# Altium schematic sheet Telemetry_temp_meas.SchDoc: Telemetry temp meas
size A4; Author: Magnus S. Aarnes; DrawnBy: Magnus Aarnes; Organization: Altium Limited; DocumentNumber: 1; Revision: 1; SheetNumber: 2; SheetTotal: 3
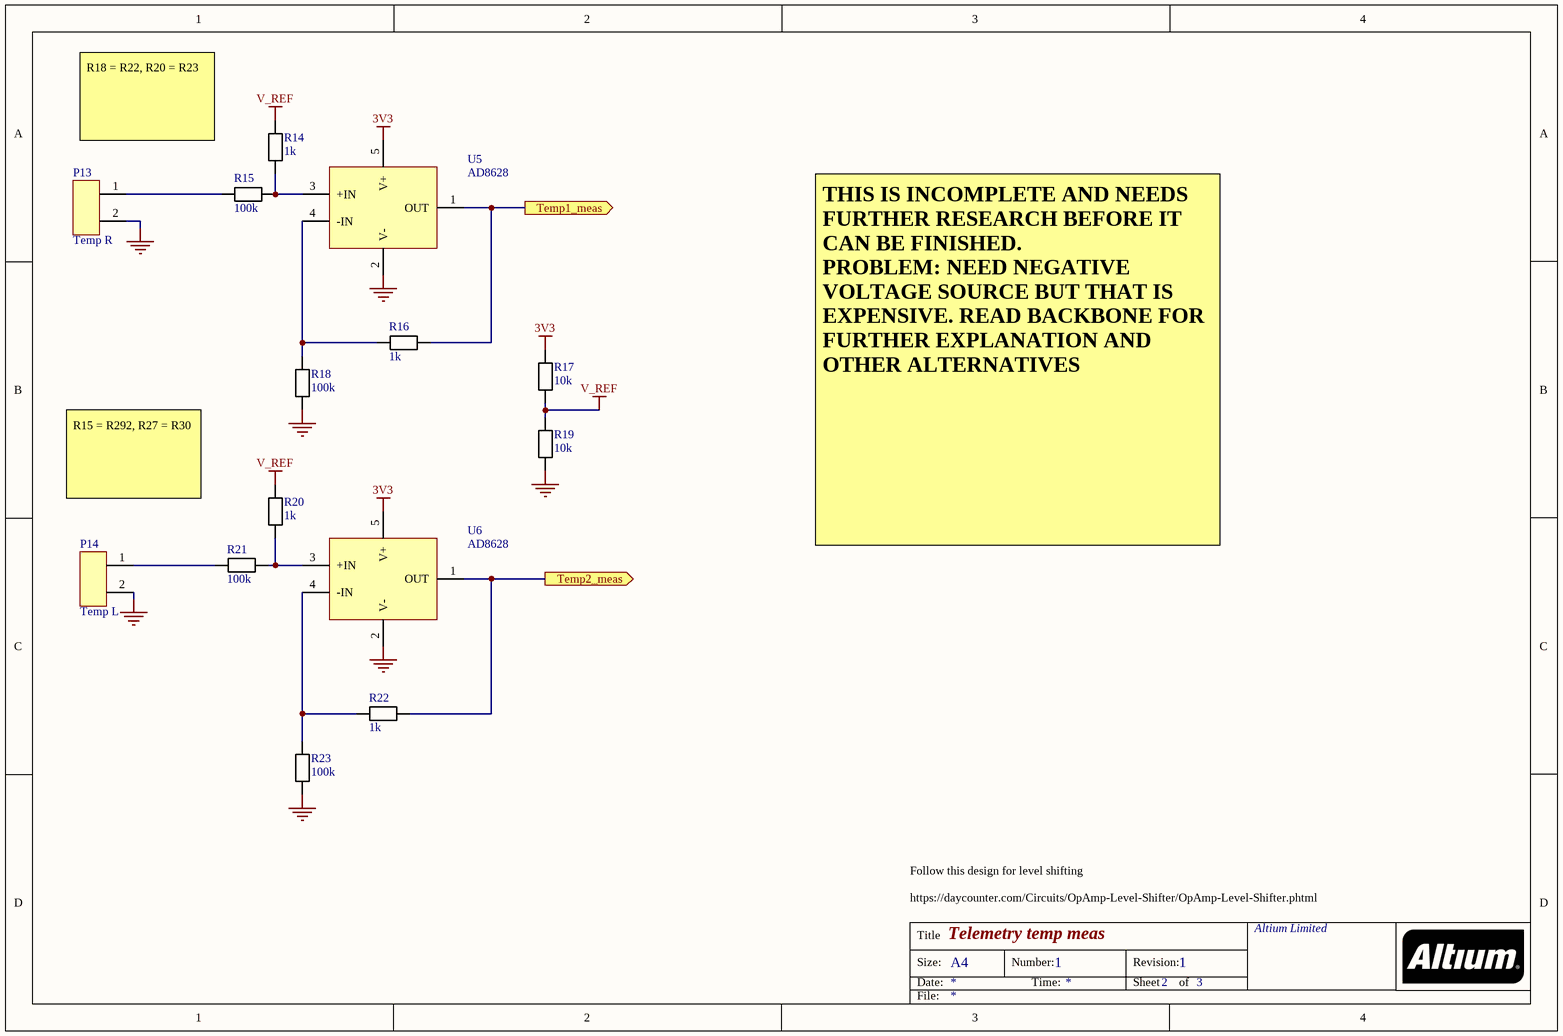
[diagram p0: Telemetry_temp_meas.SchDoc]

## Parts
P13  Temp R  [JST_SE_2PIN]
P14  Temp L  [JST_SE_2PIN]
R14  value 1k  [R_SMD_0805_pcb]  (hidden comment: SMD)
R15  value 100k  [R_SMD_0805_pcb]  (hidden comment: SMD)
R16  value 1k  [R_SMD_0805_pcb]  (hidden comment: SMD)
R17  value 10k  [R_SMD_0805_pcb]  (hidden comment: SMD)
R18  value 100k  [R_SMD_0805_pcb]  (hidden comment: SMD)
R19  value 10k  [R_SMD_0805_pcb]  (hidden comment: SMD)
R20  value 1k  [R_SMD_0805_pcb]  (hidden comment: SMD)
R21  value 100k  [R_SMD_0805_pcb]  (hidden comment: SMD)
R22  value 1k  [R_SMD_0805_pcb]  (hidden comment: SMD)
R23  value 100k  [R_SMD_0805_pcb]  (hidden comment: SMD)
U5  AD8628  [SOT-23-5]
U6  AD8628  [SOT-23-5]

## Ports
Temp1_meas (out), Temp2_meas (out)

## Nets
3V3: R17.2 U5.5(V+) U6.5(V+)
GND: P13.2 P14.2 R18.1 R19.1 R23.2 U5.2(V-) U6.2(V-)
V_REF: R14.2 R17.1 R19.2 R20.2
Temp1_meas: R16.2 U5.1(OUT) ; port Temp1_meas
Temp2_meas: R22.2 U6.1(OUT) ; port Temp2_meas
NetP13_1: P13.1 R15.1
NetP14_1: P14.1 R21.1
NetR14_1: R14.1 R15.2 U5.3(+IN)
NetR16_1: R16.1 R18.2 U5.4(-IN)
NetR20_1: R20.1 R21.2 U6.3(+IN)
NetR22_1: R22.1 R23.1 U6.4(-IN)

## Notes on the sheet
- R18 = R22, R20 = R23
- R15 = R292, R27 = R30
- THIS IS INCOMPLETE AND NEEDS FURTHER RESEARCH BEFORE IT CAN BE FINISHED.
  PROBLEM: NEED NEGATIVE VOLTAGE SOURCE BUT THAT IS EXPENSIVE. READ BACKBONE FOR FURTHER EXPLANATION AND OTHER ALTERNATIVES
- Follow this design for level shifting
  https://daycounter.com/Circuits/OpAmp-Level-Shifter/OpAmp-Level-Shifter.phtml
- Title
- Size:
- Date:
- A4
- Number:
- Time:
- Revision:
- Sheet
- of
- File:

## Library data of the parts
P13 P14 = JST_SE_2PIN: Supplier 1: *; Supplier Part Number 1: *
R14-R23 = R_SMD_0805: Supplier 1: *; Supplier Part Number 1: *
U5 U6 = AD8628WAUJZ-R7_SOT-23-5: Supplier Part Number 1: AD8628WAUJZ-R7CT-ND; Supplier Link 1: https://www.digikey.com/product-detail/en/analog-devices-inc/AD8628WAUJZ-R7/AD8628WAUJZ-R7CT-ND/2467896